# EAGLE schematic AC_schem_v95 (EAGLE 9.7.0)
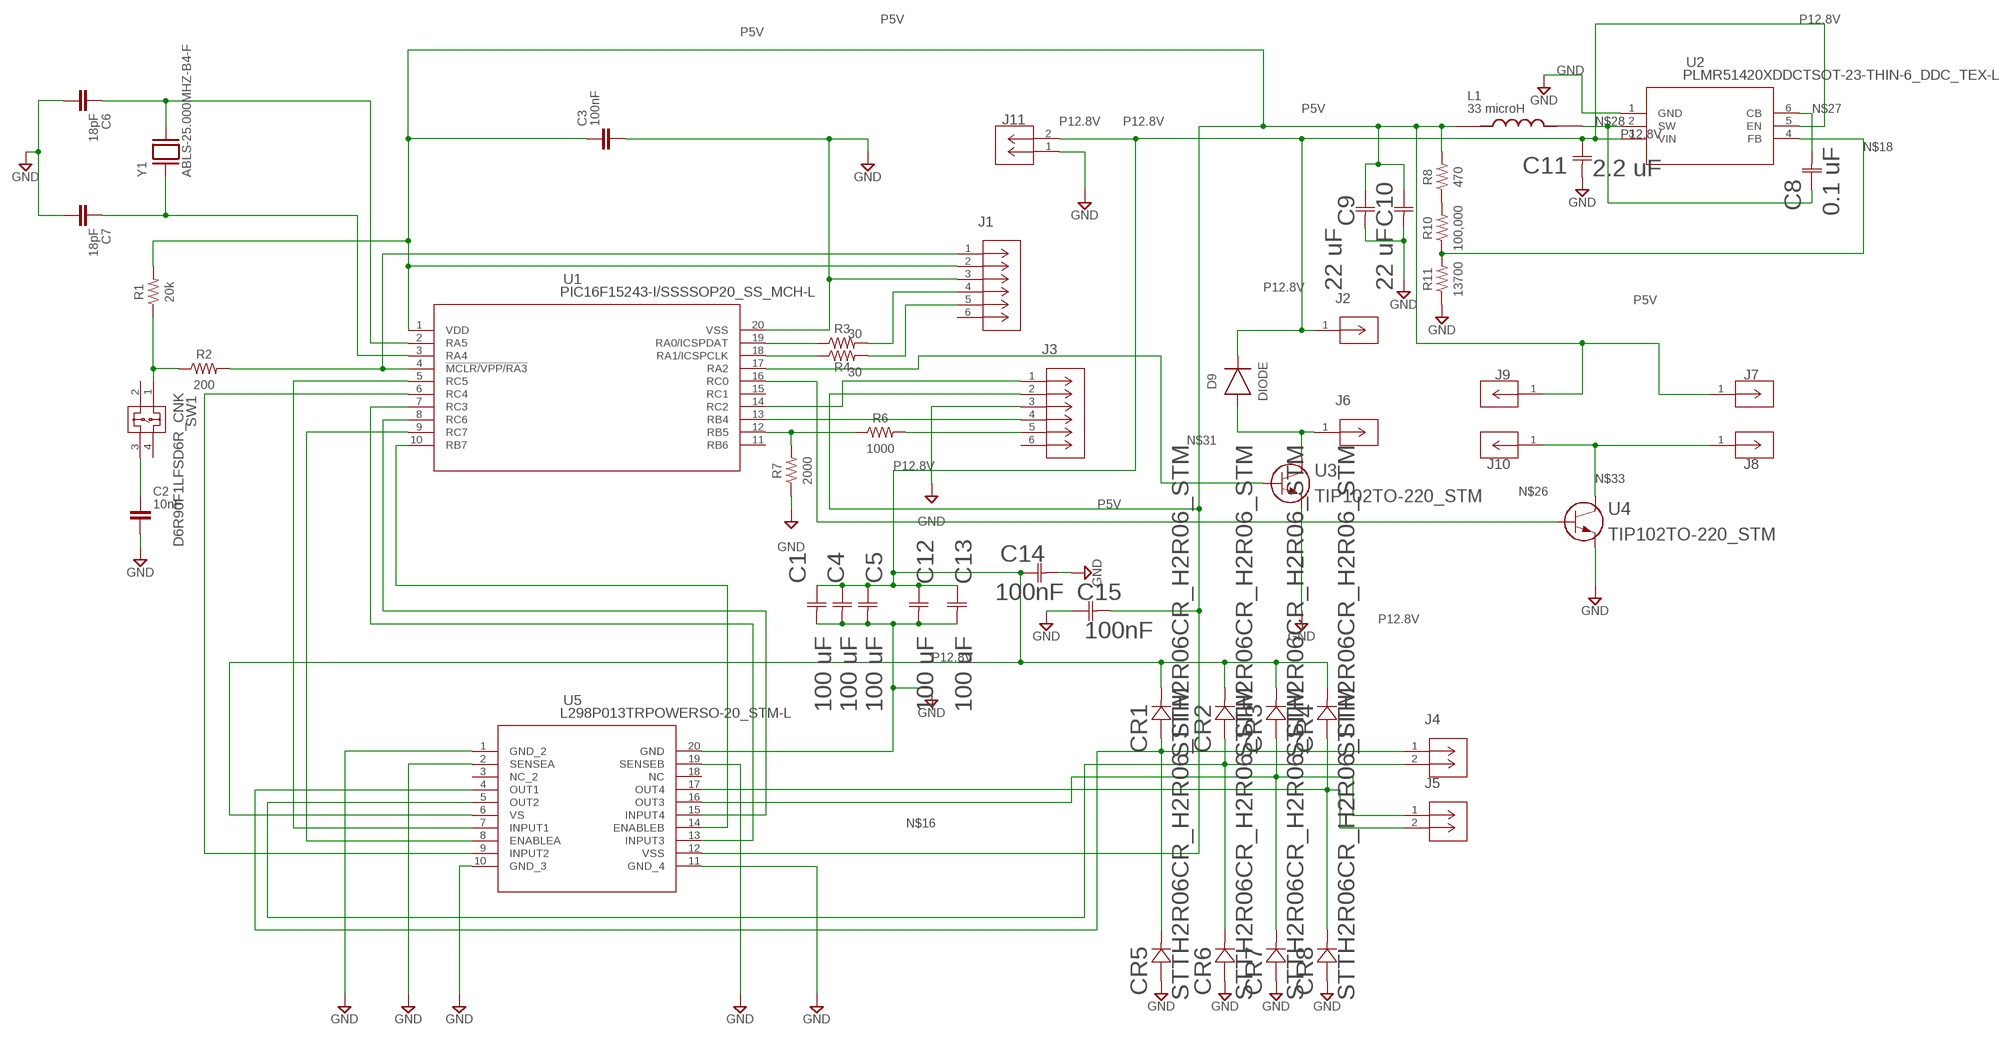
[diagram p0: schematic, sheet 1]

## Parts
C1  100 uF  CL31A107MQHNNNECAP_CL31_SAM-L  [CAP_CL31_SAM-L]
C2  10nF  C_CHIP-0805(2012-METRIC)  [CAPC2012X110]
C3  100nF  C_CHIP-0805(2012-METRIC)  [CAPC2012X110]
C4  100 uF  CL31A107MQHNNNECAP_CL31_SAM-L  [CAP_CL31_SAM-L]
C5  100 uF  CL31A107MQHNNNECAP_CL31_SAM-L  [CAP_CL31_SAM-L]
C6  18pF  C_CHIP-0805(2012-METRIC)  [CAPC2012X110]
C7  18pF  C_CHIP-0805(2012-METRIC)  [CAPC2012X110]
C8  0.1 uF  CL21A226MQQNNNECAP_CL21_SAM-L  [CAP_CL21_SAM-L]
C9  22 uF  CL21A226MQQNNNECAP_CL21_SAM-L  [CAP_CL21_SAM-L]
C10  22 uF  CL21A226MQQNNNECAP_CL21_SAM-L  [CAP_CL21_SAM-L]
C11  2.2 uF  CL21A226MQQNNNECAP_CL21_SAM-L  [CAP_CL21_SAM-L]
C12  100 uF  CL31A107MQHNNNECAP_CL31_SAM-L  [CAP_CL31_SAM-L]
C13  100 uF  CL31A107MQHNNNECAP_CL31_SAM-L  [CAP_CL31_SAM-L]
C14  100nF  CL05A104KA5NNNCCAP_CL05_SAM-L  [CAP_CL05_SAM-L]
C15  100nF  CL05A104KA5NNNCCAP_CL05_SAM-L  [CAP_CL05_SAM-L]
CR1  STTH2R06CR_H2R06_STM  [CR_H2R06_STM]
CR2  STTH2R06CR_H2R06_STM  [CR_H2R06_STM]
CR3  STTH2R06CR_H2R06_STM  [CR_H2R06_STM]
CR4  STTH2R06CR_H2R06_STM  [CR_H2R06_STM]
CR5  STTH2R06CR_H2R06_STM  [CR_H2R06_STM]
CR6  STTH2R06CR_H2R06_STM  [CR_H2R06_STM]
CR7  STTH2R06CR_H2R06_STM  [CR_H2R06_STM]
CR8  STTH2R06CR_H2R06_STM  [CR_H2R06_STM]
D9  DIODE  DIODEDO-214AB(SMC)  [DIOM7959X625N]
J1  PH1RB-06-UACONN_PH1RB-06  [CONN_PH1RB-06]
J2  SMC-1-01-1-GTCONN_SMC-1-01-1-GT_ADM  [CONN_SMC-1-01-1-GT_ADM]
J3  PPTC061LFBN-RCCONN6_061LFBN-RC_SUL  [CONN6_061LFBN-RC_SUL]
J4  PPTC021LFBN-RCCONN2_LFBN-RC_SUL  [CONN2_LFBN-RC_SUL]
J5  PPTC021LFBN-RCCONN2_LFBN-RC_SUL  [CONN2_LFBN-RC_SUL]
J6  SMC-1-01-1-GTCONN_SMC-1-01-1-GT_ADM  [CONN_SMC-1-01-1-GT_ADM]
J7  SMC-1-01-1-GTCONN_SMC-1-01-1-GT_ADM  [CONN_SMC-1-01-1-GT_ADM]
J8  SMC-1-01-1-GTCONN_SMC-1-01-1-GT_ADM  [CONN_SMC-1-01-1-GT_ADM]
J9  SMC-1-01-1-GTCONN_SMC-1-01-1-GT_ADM  [CONN_SMC-1-01-1-GT_ADM]
J10  SMC-1-01-1-GTCONN_SMC-1-01-1-GT_ADM  [CONN_SMC-1-01-1-GT_ADM]
J11  PPTC021LFBN-RCCONN2_LFBN-RC_SUL  [CONN2_LFBN-RC_SUL]
L1  33 microH  B78108E1333J000  [INDAD1430W80L950D400]
R1  20k  R-US_CHIP-0805(2012-METRIC)  [RESC2012X65]
R2  200  R-US_CHIP-0805(2012-METRIC)  [RESC2012X65]
R3  30  R-US_CHIP-0805(2012-METRIC)  [RESC2012X65]
R4  30  R-US_CHIP-0805(2012-METRIC)  [RESC2012X65]
R6  1000  R-US_CHIP-0805(2012-METRIC)  [RESC2012X65]
R7  2000  R-US_CHIP-0805(2012-METRIC)  [RESC2012X65]
R8  470  R-US_CHIP-0805(2012-METRIC)  [RESC2012X65]
R10  100,000  R-US_CHIP-0805(2012-METRIC)  [RESC2012X65]
R11  13700  R-US_CHIP-0805(2012-METRIC)  [RESC2012X65]
SW1  D6R90F1LFSD6R_CNK  [D6R_CNK]
U1  PIC16F15243-I/SSSSOP20_SS_MCH-L  [SSOP20_SS_MCH-L]
U2  PLMR51420XDDCTSOT-23-THIN-6_DDC_TEX-L  [SOT-23-THIN-6_DDC_TEX-L]
U3  TIP102TO-220_STM  [TO-220_STM]
U4  TIP102TO-220_STM  [TO-220_STM]
U5  L298P013TRPOWERSO-20_STM-L  [POWERSO-20_STM-L]
Y1  ABLS-25.000MHZ-B4-F  [XTAL_ABLS-25.000MHZ-B4-F]

## Nets
GND: C1.2 C2.2 C3.2 C4.2 C5.2 C6.2 C7.2 C9.2 C10.2 C11.2 C12.2 C13.2 C14.2 C15.1 CR5.2(K) CR6.2(K) CR7.2(K) CR8.2(K) J1.3 J3.3 J11.1 R7.1 R11.1 U1.20(VSS) U2.1(GND) U3.3(E) U4.3(E) U5.1(GND_2) U5.2(SENSEA) U5.10(GND_3) U5.11(GND_4) U5.19(SENSEB) U5.20(GND)
N$2: J3.5 R6.2
N$3: J3.4 U1.13(RB4)
N$4: J3.1 U1.14(RC2)
N$5: U1.5(RC5) U5.7(INPUT1)
N$6: U1.6(RC4) U5.9(INPUT2)
N$7: U1.9(RC7) U5.8(ENABLEA)
N$9: U1.7(RC3) U5.13(INPUT3)
N$10: U1.10(RB7) U5.14(ENABLEB)
N$11: CR2.2(K) CR6.1(A) J4.2 U5.5(OUT2)
N$12: U1.17(RA2) U3.1(B)
N$13: C2.1 SW1.3
N$14: CR1.2(K) CR5.1(A) J4.1 U5.4(OUT1)
N$15: C6.1 U1.2(RA5) Y1.2
N$16: CR3.2(K) CR7.1(A) J5.1 U5.16(OUT3)
N$17: CR4.2(K) CR8.1(A) J5.2 U5.17(OUT4)
N$18: R10.1 R11.2 U2.4(FB)
N$20: R1.1 R2.1 SW1.1
N$21: J1.1 R2.2 U1.4(!MCLR/VPP/RA3)
N$22: J1.4 R3.2
N$23: J1.5 R4.2
N$24: R3.1 U1.19(RA0/ICSPDAT)
N$25: R4.1 U1.18(RA1/ICSPCLK)
N$26: U1.16(RC0) U4.1(B)
N$27: C8.2 U2.6(CB)
N$28: C8.1 L1.2 U2.2(SW)
N$29: C7.1 U1.3(RA4) Y1.1
N$31: D9.2(A) J6.1 U3.2(C)
N$32: R6.1 R7.2 U1.12(RB5)
N$33: J8.1 J10.1 U4.2(C)
N$34: R8.1 R10.2
N$35: U1.8(RC6) U5.15(INPUT4)
P5V: C3.1 C9.1 C10.1 C15.2 J1.2 J3.2 J7.1 J9.1 L1.1 R1.2 R8.2 U1.1(VDD) U5.12(VSS)
P12.8V: C1.1 C4.1 C5.1 C11.1 C12.1 C13.1 C14.1 CR1.1(A) CR2.1(A) CR3.1(A) CR4.1(A) D9.1(C) J2.1 J11.2 U2.3(VIN) U2.5(EN) U5.6(VS)
Unconnected: J1.6 J3.6 SW1.2 SW1.4 U1.11(RB6) U1.15(RC1) U5.3(NC_2) U5.18(NC)

## Library data of the parts
C1 C4 C5 C12 C13 = 2023-12-01_22-21-38_Library:CL31A107MQHNNNE; COPYRIGHT: Copyright (C) 2023 Ultra Librarian. All rights reserved.; MANUFACTURER_PART_NUMBER: CL31A107MQHNNNE; MFR_NAME: Samsung
C2 C3 C6 C7 = Capacitor:C: Capacitor - Generic; CATEGORY: Capacitor
C8-C11 = Ceramic Cap:CL21A226MQQNNNE; COPYRIGHT: Copyright (C) 2023 Ultra Librarian. All rights reserved.; MANUFACTURER_PART_NUMBER: CL21A226MQQNNNE; MFR_NAME: Samsung
C14 C15 = 2023-12-01_23-17-33_Library:CL05A104KA5NNNC; COPYRIGHT: Copyright (C) 2023 Ultra Librarian. All rights reserved.; MANUFACTURER_PART_NUMBER: CL05A104KA5NNNC; MFR_NAME: Samsung
CR1-CR8 = 2023-11-30_20-08-36_Library:STTH2R06; COPYRIGHT: Copyright (C) 2023 Ultra Librarian. All rights reserved.; MANUFACTURER_PART_NUMBER: STTH2R06; MFR_NAME: STMicroelectronics
D9 = Diode:DIODE: Diode Rectifier - Generic; CATEGORY: Diode; SUB-CATEGORY: Rectifier
J1 = 2023-12-02_00-15-31_Library:PH1RB-06-UA; COPYRIGHT: Copyright (C) 2023 Ultra Librarian. All rights reserved.; MANUFACTURER_PART_NUMBER: PH1RB-06-UA; MFR_NAME: ADAM TECHNOLOGIES INC
J2 J6-J10 = 2023-12-01_05-05-23_Library:SMC-1-01-1-GT; COPYRIGHT: Copyright (C) 2023 Ultra Librarian. All rights reserved.; MANUFACTURER_PART_NUMBER: SMC-1-01-1-GT; MFR_NAME: ADAM TECHNOLOGIES INC
J3 = 2023-12-01_22-14-30_Library:PPTC061LFBN-RC; COPYRIGHT: Copyright (C) 2023 Ultra Librarian. All rights reserved.; MANUFACTURER_PART_NUMBER: PPTC061LFBN-RC; MFR_NAME: Sullins
J4 J5 J11 = 2023-12-02_00-02-02_Library:PPTC021LFBN-RC; COPYRIGHT: Copyright (C) 2023 Ultra Librarian. All rights reserved.; MANUFACTURER_PART_NUMBER: PPTC021LFBN-RC; MFR_NAME: Sullins
L1 = B78108E1333J000:B78108E1333J000; CHECK_PRICES: https://www.snapeda.com/parts/B78108E1333J000/EPCOS/view-part/?ref=eda; DESCRIPTION: 33 µH Unshielded Drum Core, Wirewound Inductor 1.05 A 550mOhm Max Axial; DIGIKEY_PART_NUMBER: 495-6946-2-ND; MF: EPCOS; MP: B78108E1333J000; PACKAGE: None; PURCHASE-URL: https://www.snapeda.com/api/url_track_click_mouser/?unipart_id=1650699&manufacturer=EPCOS&part_name=B78108E1333J000&search_term=None; SNAPEDA_LINK: https://www.snapeda.com/parts/B78108E1333J000/EPCOS/view-part/?ref=snap
R1-R4 R6-R8 R10 R11 = Resistor:R-US: Resistor Fixed - ANSI; CATEGORY: Resistor; SUB-CATEGORY: Fixed
SW1 = button:D6R90F1LFS; COPYRIGHT: Copyright (C) 2023 Ultra Librarian. All rights reserved.; MANUFACTURER_PART_NUMBER: D6R90F1LFS; MFR_NAME: C&K Components
U1 = 2023-10-20_19-59-51_Library:PIC16F15243-I/SS; COPYRIGHT: Copyright (C) 2023 Ultra Librarian. All rights reserved.; MANUFACTURER_PART_NUMBER: PIC16F15243-I/SS; MFR_NAME: Microchip
U2 = Voltage Regulator:PLMR51420XDDCT; COPYRIGHT: Copyright (C) 2023 Ultra Librarian. All rights reserved.; MANUFACTURER_PART_NUMBER: PLMR51420XDDCT; MFR_NAME: Texas Instruments
U3 U4 = 2023-11-17_21-15-26_Library:TIP102; COPYRIGHT: Copyright (C) 2023 Ultra Librarian. All rights reserved.; MANUFACTURER_PART_NUMBER: TIP102; MFR_NAME: STMicroelectronics
U5 = 2023-12-01_16-25-38_Library:L298P013TR; COPYRIGHT: Copyright (C) 2023 Ultra Librarian. All rights reserved.; MANUFACTURER_PART_NUMBER: L298P013TR; MFR_NAME: STMicroelectronics
Y1 = ABLS-25.000MHZ-B4-F:ABLS-25.000MHZ-B4-F; CHECK_PRICES: https://www.snapeda.com/parts/ABLS-25.000MHZ-B4-F/Abracon/view-part/?ref=eda; DESCRIPTION: HC/49US (AT49) SMD LOW PROFILE CRYSTAL; MF: Abracon Corporation; MP: ABLS-25.000MHZ-B4-F; PACKAGE: None; SNAPEDA_LINK: https://www.snapeda.com/parts/ABLS-25.000MHZ-B4-F/Abracon/view-part/?ref=snap